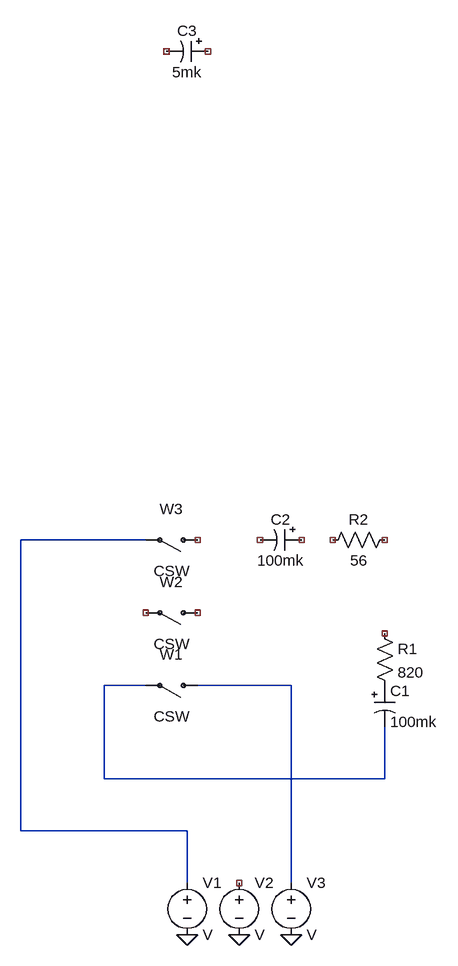
[diagram p0: schematic mikher.asc]
mikher.asc, the LTspice schematic file:
Version 4
SHEET 1 880 680
WIRE -96 -288 -288 -288
WIRE -96 -64 -160 -64
WIRE 128 -64 -16 -64
WIRE -160 80 -160 -64
WIRE 272 80 272 0
WIRE 272 80 -160 80
WIRE -288 160 -288 -288
WIRE -32 160 -288 160
WIRE -32 240 -32 160
WIRE 128 240 128 -64
FLAG -32 320 0
FLAG 48 320 0
FLAG 128 320 0
SYMBOL voltage -32 224 R0
SYMATTR InstName V1
SYMBOL voltage 48 224 R0
SYMATTR InstName V2
SYMBOL voltage 128 224 R0
SYMATTR InstName V3
SYMBOL csw -16 -64 R90
WINDOW 0 -32 40 VBottom 2
WINDOW 3 32 40 VTop 2
SYMATTR InstName W1
SYMBOL csw -16 -176 R90
WINDOW 0 -32 40 VBottom 2
WINDOW 3 32 40 VTop 2
SYMATTR InstName W2
SYMBOL csw -16 -288 R90
WINDOW 0 -32 40 VBottom 2
WINDOW 3 32 40 VTop 2
SYMATTR InstName W3
SYMBOL polcap 256 -64 R0
SYMATTR InstName C1
SYMATTR Value 100mk
SYMATTR SpiceLine V=15
SYMBOL polcap 144 -304 R90
WINDOW 0 0 32 VBottom 2
WINDOW 3 32 32 VTop 2
SYMATTR InstName C2
SYMATTR Value 100mk
SYMATTR SpiceLine V=16
SYMBOL polcap 0 -1056 R90
WINDOW 0 0 32 VBottom 2
WINDOW 3 32 32 VTop 2
SYMATTR InstName C3
SYMATTR Value 5mk
SYMATTR SpiceLine V=25
SYMBOL res 256 -160 R0
SYMATTR InstName R1
SYMATTR Value 820
SYMBOL res 288 -304 R90
WINDOW 0 0 56 VBottom 2
WINDOW 3 32 56 VTop 2
SYMATTR InstName R2
SYMATTR Value 56

The netlist it stands for:
* mikher.asc
V1 N001 0 V
V2 NC_01 0 V
V3 N003 0 V
W1 N003 N002 CSW
W2 NC_02 NC_03 CSW
W3 NC_04 N001 CSW
C1 P001 N002 100mk V=15
C2 NC_05 NC_06 100mk V=16
C3 NC_07 NC_08 5mk V=25
R1 NC_09 P001 820
R2 NC_10 NC_11 56
.backanno
.end